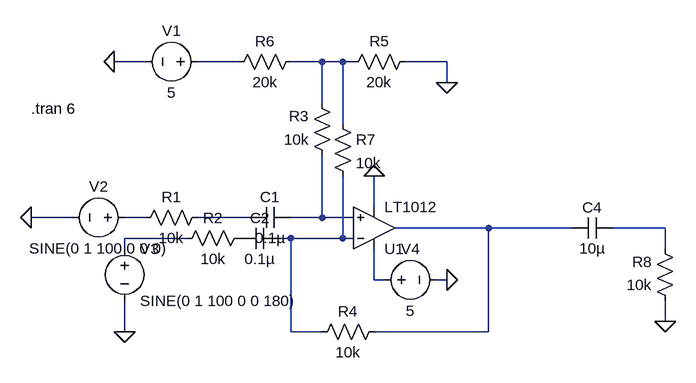
[diagram p0: schematic AudioDiffAmpSeatside.asc]
AudioDiffAmpSeatside.asc, the LTspice schematic file:
Version 4
SHEET 1 880 680
WIRE -64 48 -112 48
WIRE 80 48 16 48
WIRE 208 48 160 48
WIRE 240 48 208 48
WIRE 256 48 240 48
WIRE 400 48 336 48
WIRE 400 80 400 48
WIRE 208 112 208 48
WIRE 240 144 240 48
WIRE 288 272 288 224
WIRE -176 288 -240 288
WIRE -64 288 -96 288
WIRE 96 288 16 288
WIRE 208 288 208 192
WIRE 208 288 160 288
WIRE 256 288 208 288
WIRE 464 304 320 304
WIRE 592 304 464 304
WIRE 736 304 656 304
WIRE 0 320 -96 320
WIRE 160 320 144 320
WIRE 240 320 240 224
WIRE 240 320 160 320
WIRE 256 320 240 320
WIRE -96 336 -96 320
WIRE 736 336 736 304
WIRE 288 384 288 336
WIRE 304 384 288 384
WIRE 400 384 384 384
WIRE 736 448 736 416
WIRE -96 464 -96 416
WIRE 160 464 160 320
WIRE 208 464 160 464
WIRE 464 464 464 304
WIRE 464 464 288 464
FLAG 400 80 0
FLAG -96 464 0
FLAG -240 288 0
FLAG -112 48 0
FLAG 288 224 0
FLAG 400 384 0
FLAG 736 448 0
SYMBOL Res 32 272 R90
WINDOW 0 0 56 VBottom 2
WINDOW 3 32 56 VTop 2
SYMATTR InstName R1
SYMATTR Value 10k
SYMBOL Res 96 304 R90
WINDOW 0 0 56 VBottom 2
WINDOW 3 32 56 VTop 2
SYMATTR InstName R2
SYMATTR Value 10k
SYMBOL Res 224 208 R180
WINDOW 0 36 76 Left 2
WINDOW 3 36 40 Left 2
SYMATTR InstName R3
SYMATTR Value 10k
SYMBOL Res 192 480 R270
WINDOW 0 32 56 VTop 2
WINDOW 3 0 56 VBottom 2
SYMATTR InstName R4
SYMATTR Value 10k
SYMBOL LT1012 288 368 M180
SYMATTR InstName U1
SYMBOL Res 352 32 R90
WINDOW 0 0 56 VBottom 2
WINDOW 3 32 56 VTop 2
SYMATTR InstName R5
SYMATTR Value 20k
SYMBOL Res 176 32 R90
WINDOW 0 0 56 VBottom 2
WINDOW 3 32 56 VTop 2
SYMATTR InstName R6
SYMATTR Value 20k
SYMBOL Voltage 32 48 R90
WINDOW 0 -32 56 VBottom 2
WINDOW 3 32 56 VTop 2
SYMATTR InstName V1
SYMATTR Value 5
SYMBOL Voltage -80 288 R90
WINDOW 0 -32 56 VBottom 2
WINDOW 3 32 56 VTop 2
SYMATTR InstName V2
SYMATTR Value SINE(0 1 100 0 0 0)
SYMBOL Voltage -96 320 R0
SYMATTR InstName V3
SYMATTR Value SINE(0 1 100 0 0 180)
SYMBOL Voltage 288 384 R270
WINDOW 0 32 56 VTop 2
WINDOW 3 -32 56 VBottom 2
SYMATTR InstName V4
SYMATTR Value 5
SYMBOL Cap 160 272 R90
WINDOW 0 0 32 VBottom 2
WINDOW 3 32 32 VTop 2
SYMATTR InstName C1
SYMATTR Value 0.1µ
SYMBOL Cap 144 304 R90
WINDOW 0 0 32 VBottom 2
WINDOW 3 32 32 VTop 2
SYMATTR InstName C2
SYMATTR Value 0.1µ
SYMBOL Res 224 128 R0
SYMATTR InstName R7
SYMATTR Value 10k
SYMBOL Cap 656 288 R90
WINDOW 0 0 32 VBottom 2
WINDOW 3 32 32 VTop 2
SYMATTR InstName C4
SYMATTR Value 10µ
SYMBOL Res 752 432 R180
WINDOW 0 36 76 Left 2
WINDOW 3 36 40 Left 2
SYMATTR InstName R8
SYMATTR Value 10k
TEXT -240 120 Left 2 !.tran 6

The netlist it stands for:
* AudioDiffAmpSeatside.asc
R1 N004 N003 10k
R2 P001 N008 10k
R3 N005 N002 10k
R4 N009 N006 10k
* U1: LT1012 (symbol LT1012 not available, pins judged from their places): In+=N005 In-=N009 V+=N010 V-=0 OUT=N006
R5 0 N002 20k
R6 N002 N001 20k
V1 N001 0 5
V2 N003 0 SINE(0 1 100 0 0 0)
V3 N008 0 SINE(0 1 100 0 0 180)
V4 N010 0 5
C1 N005 N004 0.1µ
C2 N009 P001 0.1µ
R7 N002 N009 10k
C4 N007 N006 10µ
R8 0 N007 10k
.tran 6
.backanno
.end